# EAGLE design DEClampPanel (EAGLE 7.6.0)
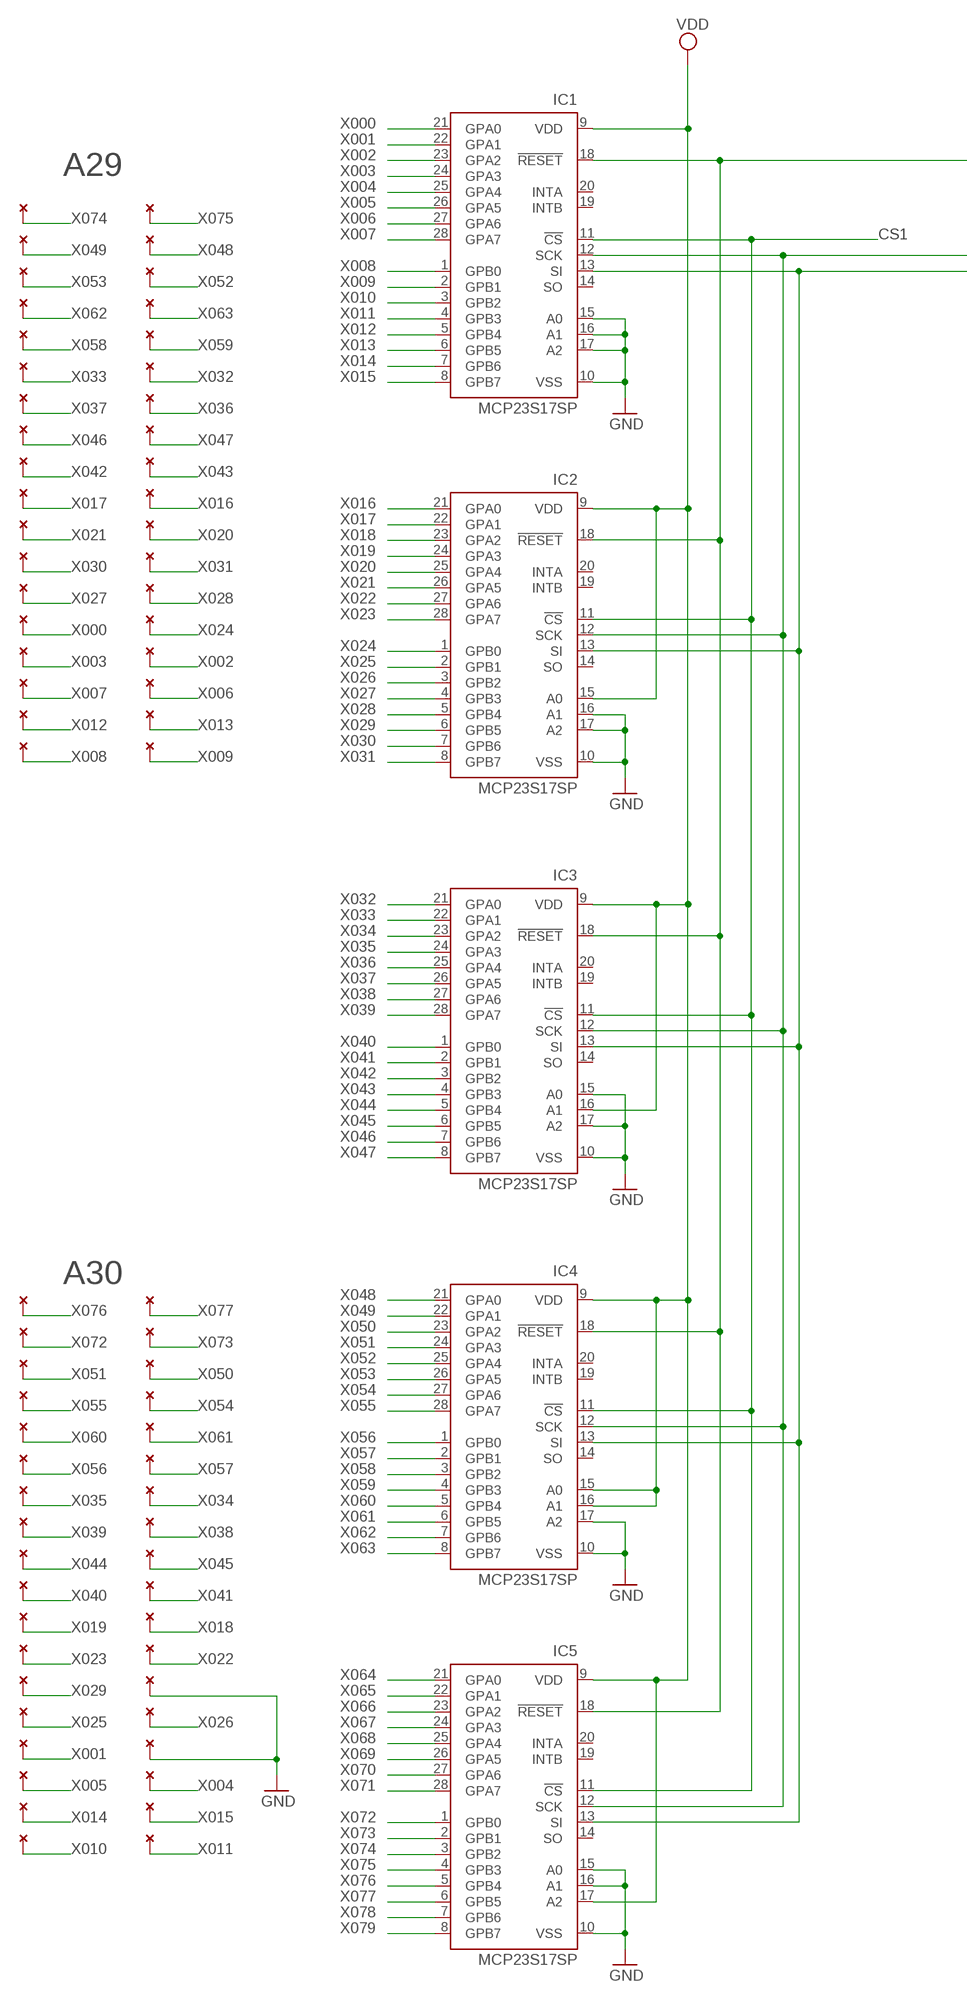
[diagram p0: schematic, sheet 1, part 1 of 2]
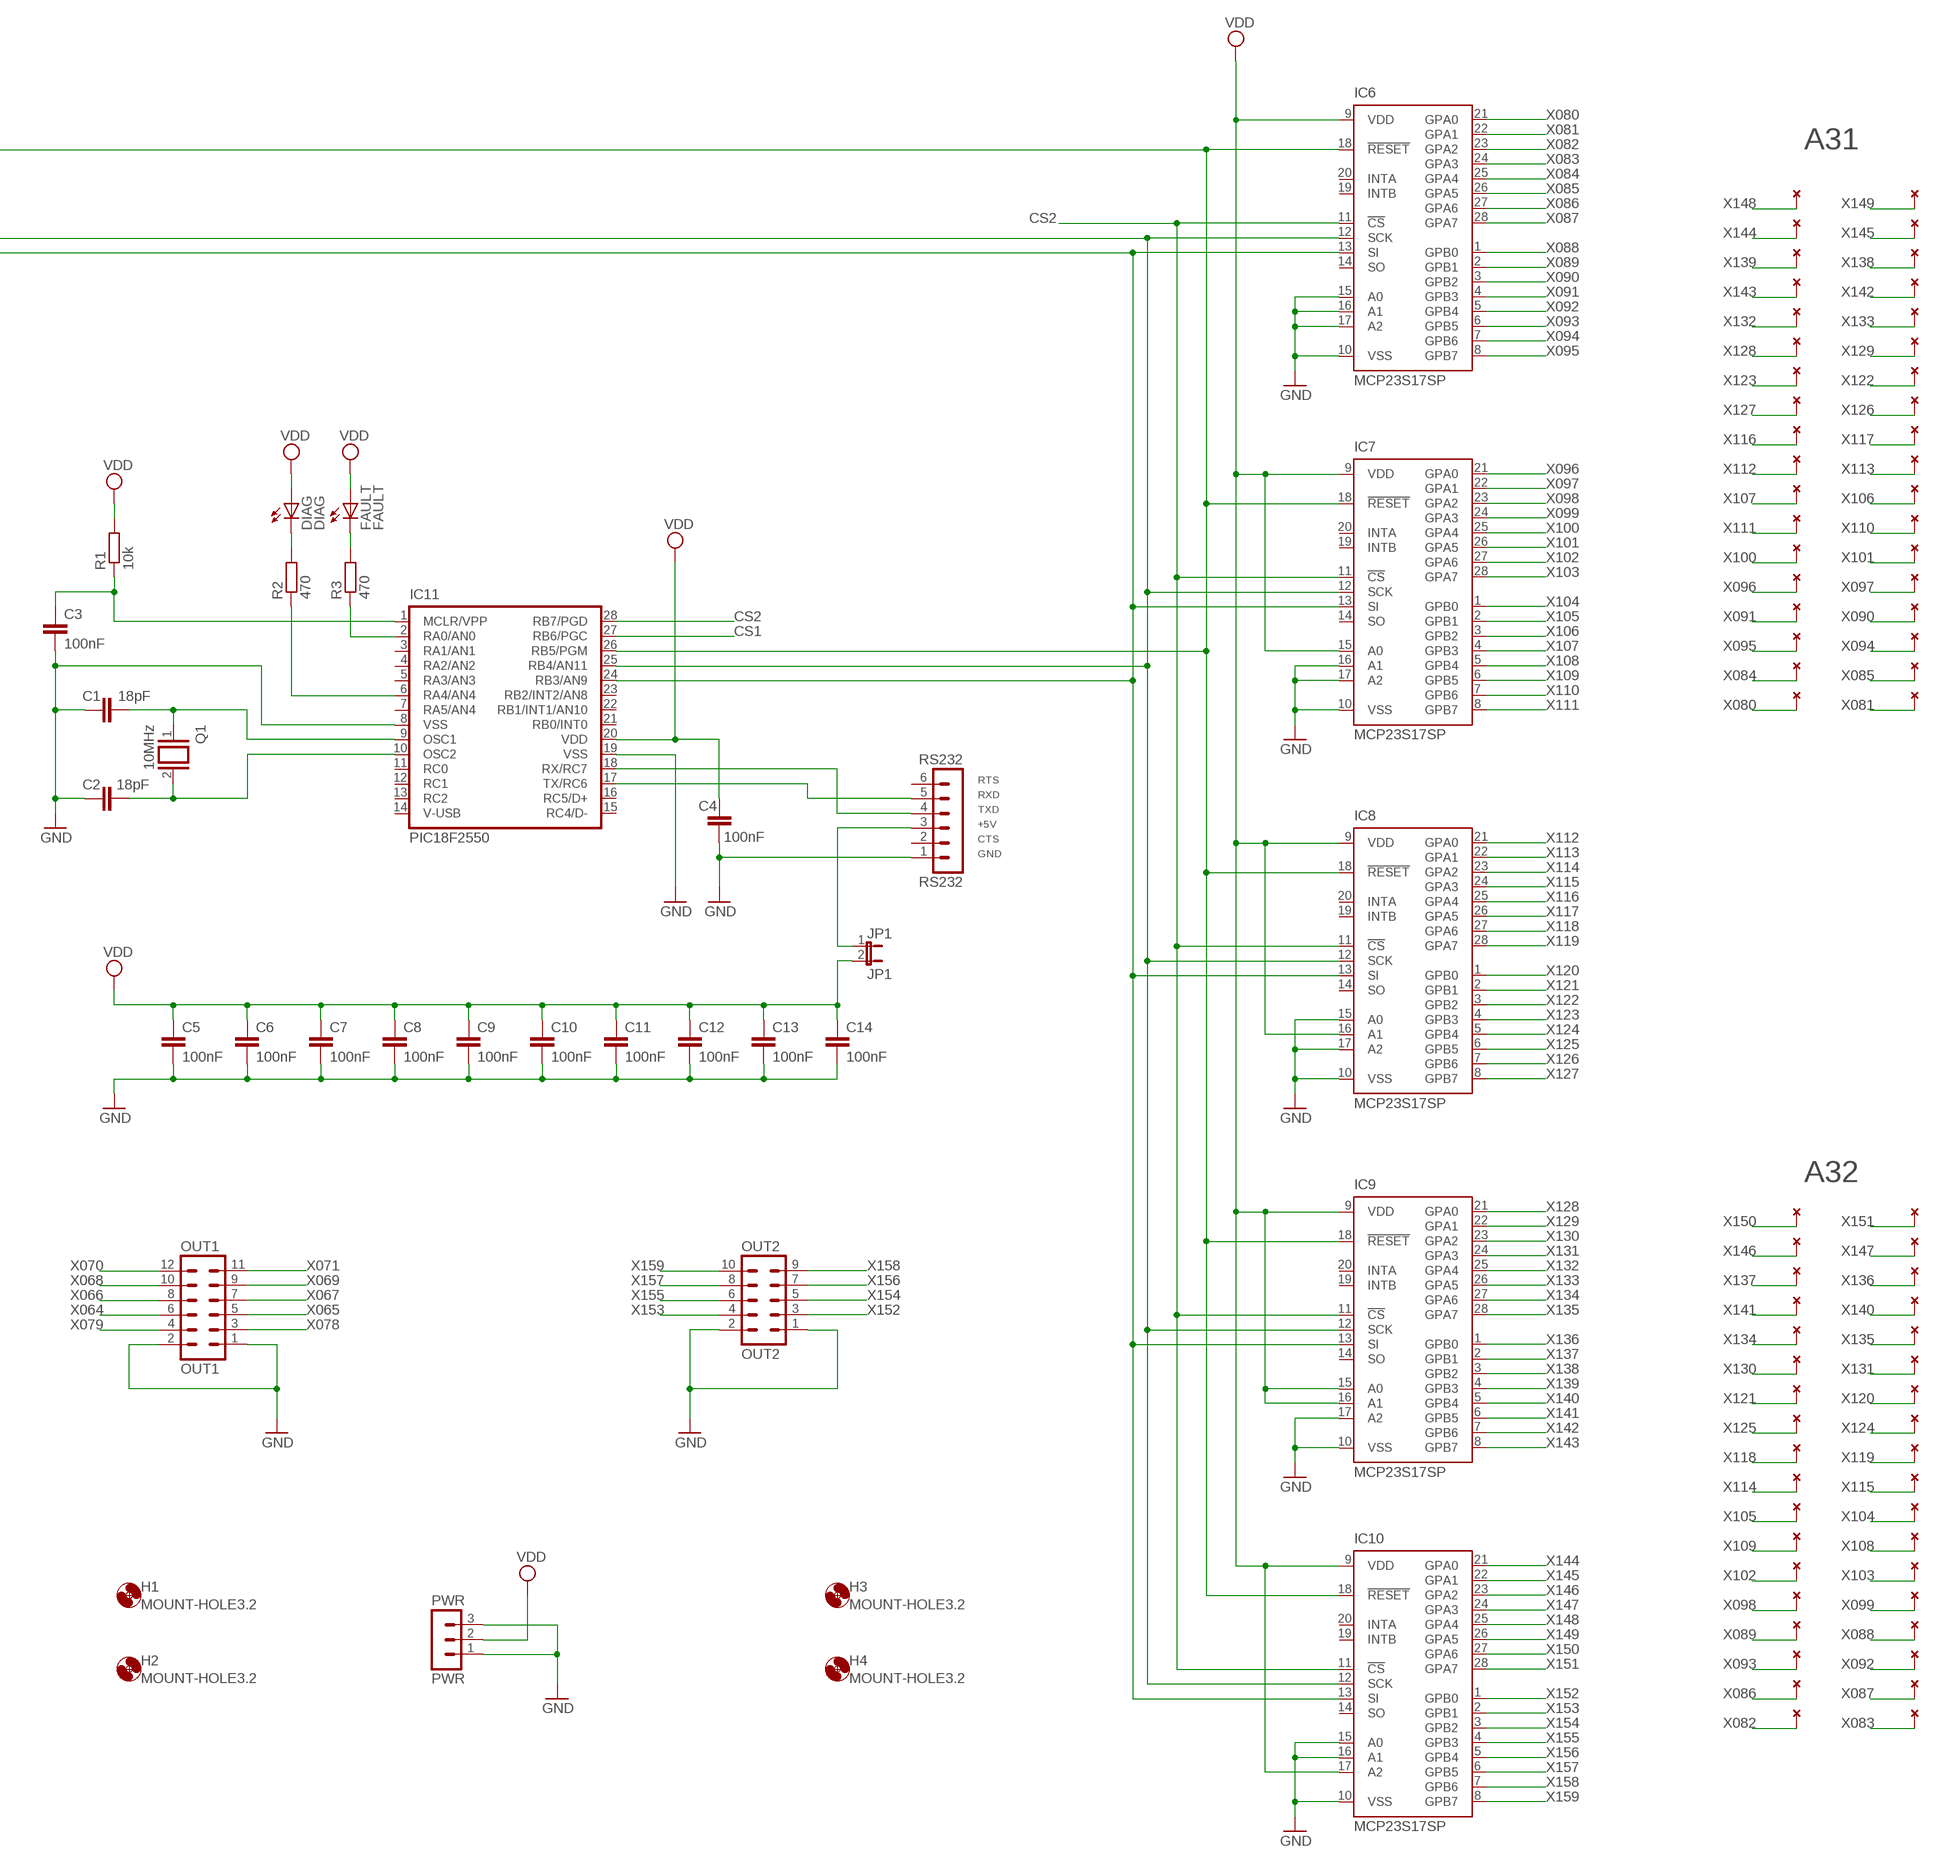
[diagram p1: schematic, sheet 1, part 2 of 2]

## Parts
A29  THRU-HOLE2W  [THRU-HOLE2]
A30  THRU-HOLE2W  [THRU-HOLE2]
A31  THRU-HOLE2W  [THRU-HOLE2]
A32  THRU-HOLE2W  [THRU-HOLE2]
C1  18pF  C-EU025-025X050  [C025-025X050]
C2  18pF  C-EU025-025X050  [C025-025X050]
C3  100nF  C-EU025-025X050  [C025-025X050]
C4  100nF  C-EU025-025X050  [C025-025X050]
C5  100nF  C-EU025-025X050  [C025-025X050]
C6  100nF  C-EU025-025X050  [C025-025X050]
C7  100nF  C-EU025-025X050  [C025-025X050]
C8  100nF  C-EU025-025X050  [C025-025X050]
C9  100nF  C-EU025-025X050  [C025-025X050]
C10  100nF  C-EU025-025X050  [C025-025X050]
C11  100nF  C-EU025-025X050  [C025-025X050]
C12  100nF  C-EU025-025X050  [C025-025X050]
C13  100nF  C-EU025-025X050  [C025-025X050]
C14  100nF  C-EU025-025X050  [C025-025X050]
DIAG  DIAG  LED3MM  [LED3MM]
FAULT  FAULT  LED3MM  [LED3MM]
H1  MOUNT-HOLE3.2  [3,2]
H2  MOUNT-HOLE3.2  [3,2]
H3  MOUNT-HOLE3.2  [3,2]
H4  MOUNT-HOLE3.2  [3,2]
IC1  MCP23S17SP  [DIL28-3]
IC2  MCP23S17SP  [DIL28-3]
IC3  MCP23S17SP  [DIL28-3]
IC4  MCP23S17SP  [DIL28-3]
IC5  MCP23S17SP  [DIL28-3]
IC6  MCP23S17SP  [DIL28-3]
IC7  MCP23S17SP  [DIL28-3]
IC8  MCP23S17SP  [DIL28-3]
IC9  MCP23S17SP  [DIL28-3]
IC10  MCP23S17SP  [DIL28-3]
IC11  PIC18F2550  [DIL28-3]
JP1  JP1  JUMPER-2PTH  [1X02]
OUT1  OUT1  MA06-2  [MA06-2]
OUT2  OUT2  MA05-2  [MA05-2]
PWR  PWR  MA03-1  [MA03-1]
Q1  10MHz  XTAL/S  [QS]
R1  10k  R-EU_0204/7  [0204/7]
R2  470  R-EU_0204/7  [0204/7]
R3  470  R-EU_0204/7  [0204/7]
RS232  RS232  MA06-1  [MA06-1]

## Nets
CS1: IC1.11(!CS) IC2.11(!CS) IC3.11(!CS) IC4.11(!CS) IC5.11(!CS) IC11.27(RB6/PGC)
CS2: IC6.11(!CS) IC7.11(!CS) IC8.11(!CS) IC9.11(!CS) IC10.11(!CS) IC11.28(RB7/PGD)
GND [GND]: A30.D2 A30.F2 C1.1 C2.1 C3.2 C4.2 C5.2 C6.2 C7.2 C8.2 C9.2 C10.2 C11.2 C12.2 C13.2 C14.2 IC1.10(VSS) IC1.15(A0) IC1.16(A1) IC1.17(A2) IC2.10(VSS) IC2.16(A1) IC2.17(A2) IC3.10(VSS) IC3.15(A0) IC3.17(A2) IC4.10(VSS) IC4.17(A2) IC5.10(VSS) IC5.15(A0) IC5.16(A1) IC6.10(VSS) IC6.15(A0) IC6.16(A1) IC6.17(A2) IC7.10(VSS) IC7.16(A1) IC7.17(A2) IC8.10(VSS) IC8.15(A0) IC8.17(A2) IC9.10(VSS) IC9.17(A2) IC10.10(VSS) IC10.15(A0) IC10.16(A1) IC11.8(VSS) IC11.19(VSS) OUT1.1 OUT1.2 OUT2.1 OUT2.2 PWR.1 PWR.3 RS232.1
N$1: IC1.18(!RESET) IC2.18(!RESET) IC3.18(!RESET) IC4.18(!RESET) IC5.18(!RESET) IC6.18(!RESET) IC7.18(!RESET) IC8.18(!RESET) IC9.18(!RESET) IC10.18(!RESET) IC11.26(RB5/PGM)
N$2: C1.2 IC11.9(OSC1) Q1.1
N$3: IC1.12(SCK) IC2.12(SCK) IC3.12(SCK) IC4.12(SCK) IC5.12(SCK) IC6.12(SCK) IC7.12(SCK) IC8.12(SCK) IC9.12(SCK) IC10.12(SCK) IC11.25(RB4/AN11)
N$4: IC1.13(SI) IC2.13(SI) IC3.13(SI) IC4.13(SI) IC5.13(SI) IC6.13(SI) IC7.13(SI) IC8.13(SI) IC9.13(SI) IC10.13(SI) IC11.24(RB3/AN9)
N$5: FAULT.K(C) R3.2
N$6: C2.2 IC11.10(OSC2) Q1.2
N$7: JP1.1 RS232.3
N$8: IC11.18(RX/RC7) RS232.4
N$9: IC11.17(TX/RC6) RS232.5
N$10: IC11.2(RA0/AN0) R3.1
N$11: C3.1 IC11.1(MCLR/VPP) R1.1
N$12: DIAG.K(C) R2.2
N$13: IC11.6(RA4/AN4) R2.1
VDD [VDD]: C4.1 C5.1 C6.1 C7.1 C8.1 C9.1 C10.1 C11.1 C12.1 C13.1 C14.1 DIAG.A FAULT.A IC1.9(VDD) IC2.9(VDD) IC2.15(A0) IC3.9(VDD) IC3.16(A1) IC4.9(VDD) IC4.15(A0) IC4.16(A1) IC5.9(VDD) IC5.17(A2) IC6.9(VDD) IC7.9(VDD) IC7.15(A0) IC8.9(VDD) IC8.16(A1) IC9.9(VDD) IC9.15(A0) IC9.16(A1) IC10.9(VDD) IC10.17(A2) IC11.20(VDD) JP1.2 PWR.2 R1.2
X000: A29.E1 IC1.21(GPA0)
X001: A30.D1 IC1.22(GPA1)
X002: A29.D2 IC1.23(GPA2)
X003: A29.D1 IC1.24(GPA3)
X004: A30.C2 IC1.25(GPA4)
X005: A30.C1 IC1.26(GPA5)
X006: A29.C2 IC1.27(GPA6)
X007: A29.C1 IC1.28(GPA7)
X008: A29.A1 IC1.1(GPB0)
X009: A29.A2 IC1.2(GPB1)
X010: A30.A1 IC1.3(GPB2)
X011: A30.A2 IC1.4(GPB3)
X012: A29.B1 IC1.5(GPB4)
X013: A29.B2 IC1.6(GPB5)
X014: A30.B1 IC1.7(GPB6)
X015: A30.B2 IC1.8(GPB7)
X016: A29.K2 IC2.21(GPA0)
X017: A29.K1 IC2.22(GPA1)
X018: A30.J2 IC2.23(GPA2)
X019: A30.J1 IC2.24(GPA3)
X020: A29.J2 IC2.25(GPA4)
X021: A29.J1 IC2.26(GPA5)
X022: A30.H2 IC2.27(GPA6)
X023: A30.H1 IC2.28(GPA7)
X024: A29.E2 IC2.1(GPB0)
X025: A30.E1 IC2.2(GPB1)
X026: A30.E2 IC2.3(GPB2)
X027: A29.F1 IC2.4(GPB3)
X028: A29.F2 IC2.5(GPB4)
X029: A30.F1 IC2.6(GPB5)
X030: A29.H1 IC2.7(GPB6)
X031: A29.H2 IC2.8(GPB7)
X032: A29.P2 IC3.21(GPA0)
X033: A29.P1 IC3.22(GPA1)
X034: A30.N2 IC3.23(GPA2)
X035: A30.N1 IC3.24(GPA3)
X036: A29.N2 IC3.25(GPA4)
X037: A29.N1 IC3.26(GPA5)
X038: A30.M2 IC3.27(GPA6)
X039: A30.M1 IC3.28(GPA7)
X040: A30.K1 IC3.1(GPB0)
X041: A30.K2 IC3.2(GPB1)
X042: A29.L1 IC3.3(GPB2)
X043: A29.L2 IC3.4(GPB3)
X044: A30.L1 IC3.5(GPB4)
X045: A30.L2 IC3.6(GPB5)
X046: A29.M1 IC3.7(GPB6)
X047: A29.M2 IC3.8(GPB7)
X048: A29.U2 IC4.21(GPA0)
X049: A29.U1 IC4.22(GPA1)
X050: A30.T2 IC4.23(GPA2)
X051: A30.T1 IC4.24(GPA3)
X052: A29.T2 IC4.25(GPA4)
X053: A29.T1 IC4.26(GPA5)
X054: A30.S2 IC4.27(GPA6)
X055: A30.S1 IC4.28(GPA7)
X056: A30.P1 IC4.1(GPB0)
X057: A30.P2 IC4.2(GPB1)
X058: A29.R1 IC4.3(GPB2)
X059: A29.R2 IC4.4(GPB3)
X060: A30.R1 IC4.5(GPB4)
X061: A30.R2 IC4.6(GPB5)
X062: A29.S1 IC4.7(GPB6)
X063: A29.S2 IC4.8(GPB7)
X064: IC5.21(GPA0) OUT1.6
X065: IC5.22(GPA1) OUT1.5
X066: IC5.23(GPA2) OUT1.8
X067: IC5.24(GPA3) OUT1.7
X068: IC5.25(GPA4) OUT1.10
X069: IC5.26(GPA5) OUT1.9
X070: IC5.27(GPA6) OUT1.12
X071: IC5.28(GPA7) OUT1.11
X072: A30.U1 IC5.1(GPB0)
X073: A30.U2 IC5.2(GPB1)
X074: A29.V1 IC5.3(GPB2)
X075: A29.V2 IC5.4(GPB3)
X076: A30.V1 IC5.5(GPB4)
X077: A30.V2 IC5.6(GPB5)
X078: IC5.7(GPB6) OUT1.3
X079: IC5.8(GPB7) OUT1.4
X080: A31.A1 IC6.21(GPA0)
X081: A31.A2 IC6.22(GPA1)
X082: A32.A1 IC6.23(GPA2)
X083: A32.A2 IC6.24(GPA3)
X084: A31.B1 IC6.25(GPA4)
X085: A31.B2 IC6.26(GPA5)
X086: A32.B1 IC6.27(GPA6)
X087: A32.B2 IC6.28(GPA7)
X088: A32.D2 IC6.1(GPB0)
X089: A32.D1 IC6.2(GPB1)
X090: A31.D2 IC6.3(GPB2)
X091: A31.D1 IC6.4(GPB3)
X092: A32.C2 IC6.5(GPB4)
X093: A32.C1 IC6.6(GPB5)
X094: A31.C2 IC6.7(GPB6)
X095: A31.C1 IC6.8(GPB7)
X096: A31.E1 IC7.21(GPA0)
X097: A31.E2 IC7.22(GPA1)
X098: A32.E1 IC7.23(GPA2)
X099: A32.E2 IC7.24(GPA3)
X100: A31.F1 IC7.25(GPA4)
X101: A31.F2 IC7.26(GPA5)
X102: A32.F1 IC7.27(GPA6)
X103: A32.F2 IC7.28(GPA7)
X104: A32.J2 IC7.1(GPB0)
X105: A32.J1 IC7.2(GPB1)
X106: A31.J2 IC7.3(GPB2)
X107: A31.J1 IC7.4(GPB3)
X108: A32.H2 IC7.5(GPB4)
X109: A32.H1 IC7.6(GPB5)
X110: A31.H2 IC7.7(GPB6)
X111: A31.H1 IC7.8(GPB7)
X112: A31.K1 IC8.21(GPA0)
X113: A31.K2 IC8.22(GPA1)
X114: A32.K1 IC8.23(GPA2)
X115: A32.K2 IC8.24(GPA3)
X116: A31.L1 IC8.25(GPA4)
X117: A31.L2 IC8.26(GPA5)
X118: A32.L1 IC8.27(GPA6)
X119: A32.L2 IC8.28(GPA7)
X120: A32.N2 IC8.1(GPB0)
X121: A32.N1 IC8.2(GPB1)
X122: A31.N2 IC8.3(GPB2)
X123: A31.N1 IC8.4(GPB3)
X124: A32.M2 IC8.5(GPB4)
X125: A32.M1 IC8.6(GPB5)
X126: A31.M2 IC8.7(GPB6)
X127: A31.M1 IC8.8(GPB7)
X128: A31.P1 IC9.21(GPA0)
X129: A31.P2 IC9.22(GPA1)
X130: A32.P1 IC9.23(GPA2)
X131: A32.P2 IC9.24(GPA3)
X132: A31.R1 IC9.25(GPA4)
X133: A31.R2 IC9.26(GPA5)
X134: A32.R1 IC9.27(GPA6)
X135: A32.R2 IC9.28(GPA7)
X136: A32.T2 IC9.1(GPB0)
X137: A32.T1 IC9.2(GPB1)
X138: A31.T2 IC9.3(GPB2)
X139: A31.T1 IC9.4(GPB3)
X140: A32.S2 IC9.5(GPB4)
X141: A32.S1 IC9.6(GPB5)
X142: A31.S2 IC9.7(GPB6)
X143: A31.S1 IC9.8(GPB7)
X144: A31.U1 IC10.21(GPA0)
X145: A31.U2 IC10.22(GPA1)
X146: A32.U1 IC10.23(GPA2)
X147: A32.U2 IC10.24(GPA3)
X148: A31.V1 IC10.25(GPA4)
X149: A31.V2 IC10.26(GPA5)
X150: A32.V1 IC10.27(GPA6)
X151: A32.V2 IC10.28(GPA7)
X152: IC10.1(GPB0) OUT2.3
X153: IC10.2(GPB1) OUT2.4
X154: IC10.3(GPB2) OUT2.5
X155: IC10.4(GPB3) OUT2.6
X156: IC10.5(GPB4) OUT2.7
X157: IC10.6(GPB5) OUT2.8
X158: IC10.7(GPB6) OUT2.9
X159: IC10.8(GPB7) OUT2.10
Unconnected: IC1.14(SO) IC1.19(INTB) IC1.20(INTA) IC2.14(SO) IC2.19(INTB) IC2.20(INTA) IC3.14(SO) IC3.19(INTB) IC3.20(INTA) IC4.14(SO) IC4.19(INTB) IC4.20(INTA) IC5.14(SO) IC5.19(INTB) IC5.20(INTA) IC6.14(SO) IC6.19(INTB) IC6.20(INTA) IC7.14(SO) IC7.19(INTB) IC7.20(INTA) IC8.14(SO) IC8.19(INTB) IC8.20(INTA) IC9.14(SO) IC9.19(INTB) IC9.20(INTA) IC10.14(SO) IC10.19(INTB) IC10.20(INTA) IC11.3(RA1/AN1) IC11.4(RA2/AN2) IC11.5(RA3/AN3) IC11.7(RA5/AN4) IC11.11(RC0) IC11.12(RC1) IC11.13(RC2) IC11.14(V-USB) IC11.15(RC4/D-) IC11.16(RC5/D+) IC11.21(RB0/INT0) IC11.22(RB1/INT1/AN10) IC11.23(RB2/INT2/AN8) RS232.2 RS232.6

## Notes on the sheet
- A31
- A29
- RTS
- RXD
- TXD
- +5V
- CTS
- GND
- A32
- A30

## Library data of the parts
A29-A32 = dec-con:THRU-HOLE2: Thru-Hole addition to double-sided edge connector.
C1-C14 = rcl:C-EU: CAPACITOR, European symbol
DIAG FAULT = henk:LED: LEDs Standard schematic elements and footprints for 5mm, 3mm, 1206, and 0603 sized LEDs. 5mm - Spark Fun Electronics SKU : COM-00529 (and others)
H1-H4 = holes:MOUNT-HOLE: MOUNTING HOLE with drill center marker
IC1-IC10 = microchip:MCP23S17: http://ww1.microchip.com/downloads/en/DeviceDoc/21952a.pdf Source: http://ww1.microchip.com/downloads/en/DeviceDoc/21952a.pdf; MF: MICROCHIP; MPN: MCP23S17-E/SP; OC_FARNELL: 1292238; OC_NEWARK: 31K2951
IC11 = henk:PIC18F2550
JP1 = henk:JUMPER-2: Jumper Basic 0.1" spaced jumper. Use with breakaway headers.
OUT1 = con-lstb:MA06-2: PIN HEADER; OC_FARNELL: unknown; OC_NEWARK: unknown
OUT2 = con-lstb:MA05-2: PIN HEADER; OC_FARNELL: unknown; OC_NEWARK: unknown
PWR = con-lstb:MA03-1: PIN HEADER; OC_FARNELL: unknown; OC_NEWARK: unknown
Q1 = special:XTAL/S: CRYSTAL
R1-R3 = rcl:R-EU_: RESISTOR, European symbol
RS232 = con-lstb:MA06-1: PIN HEADER; OC_FARNELL: unknown; OC_NEWARK: unknown

## Net classes
0 default: width 0.254 mm, drill 0.254 mm, clearance 0.254 mm
1 GND: width 0.508 mm, drill 0.508 mm, clearance 0.254 mm
2 VDD: width 0.508 mm, drill 0.508 mm, clearance 0.254 mm

## Board
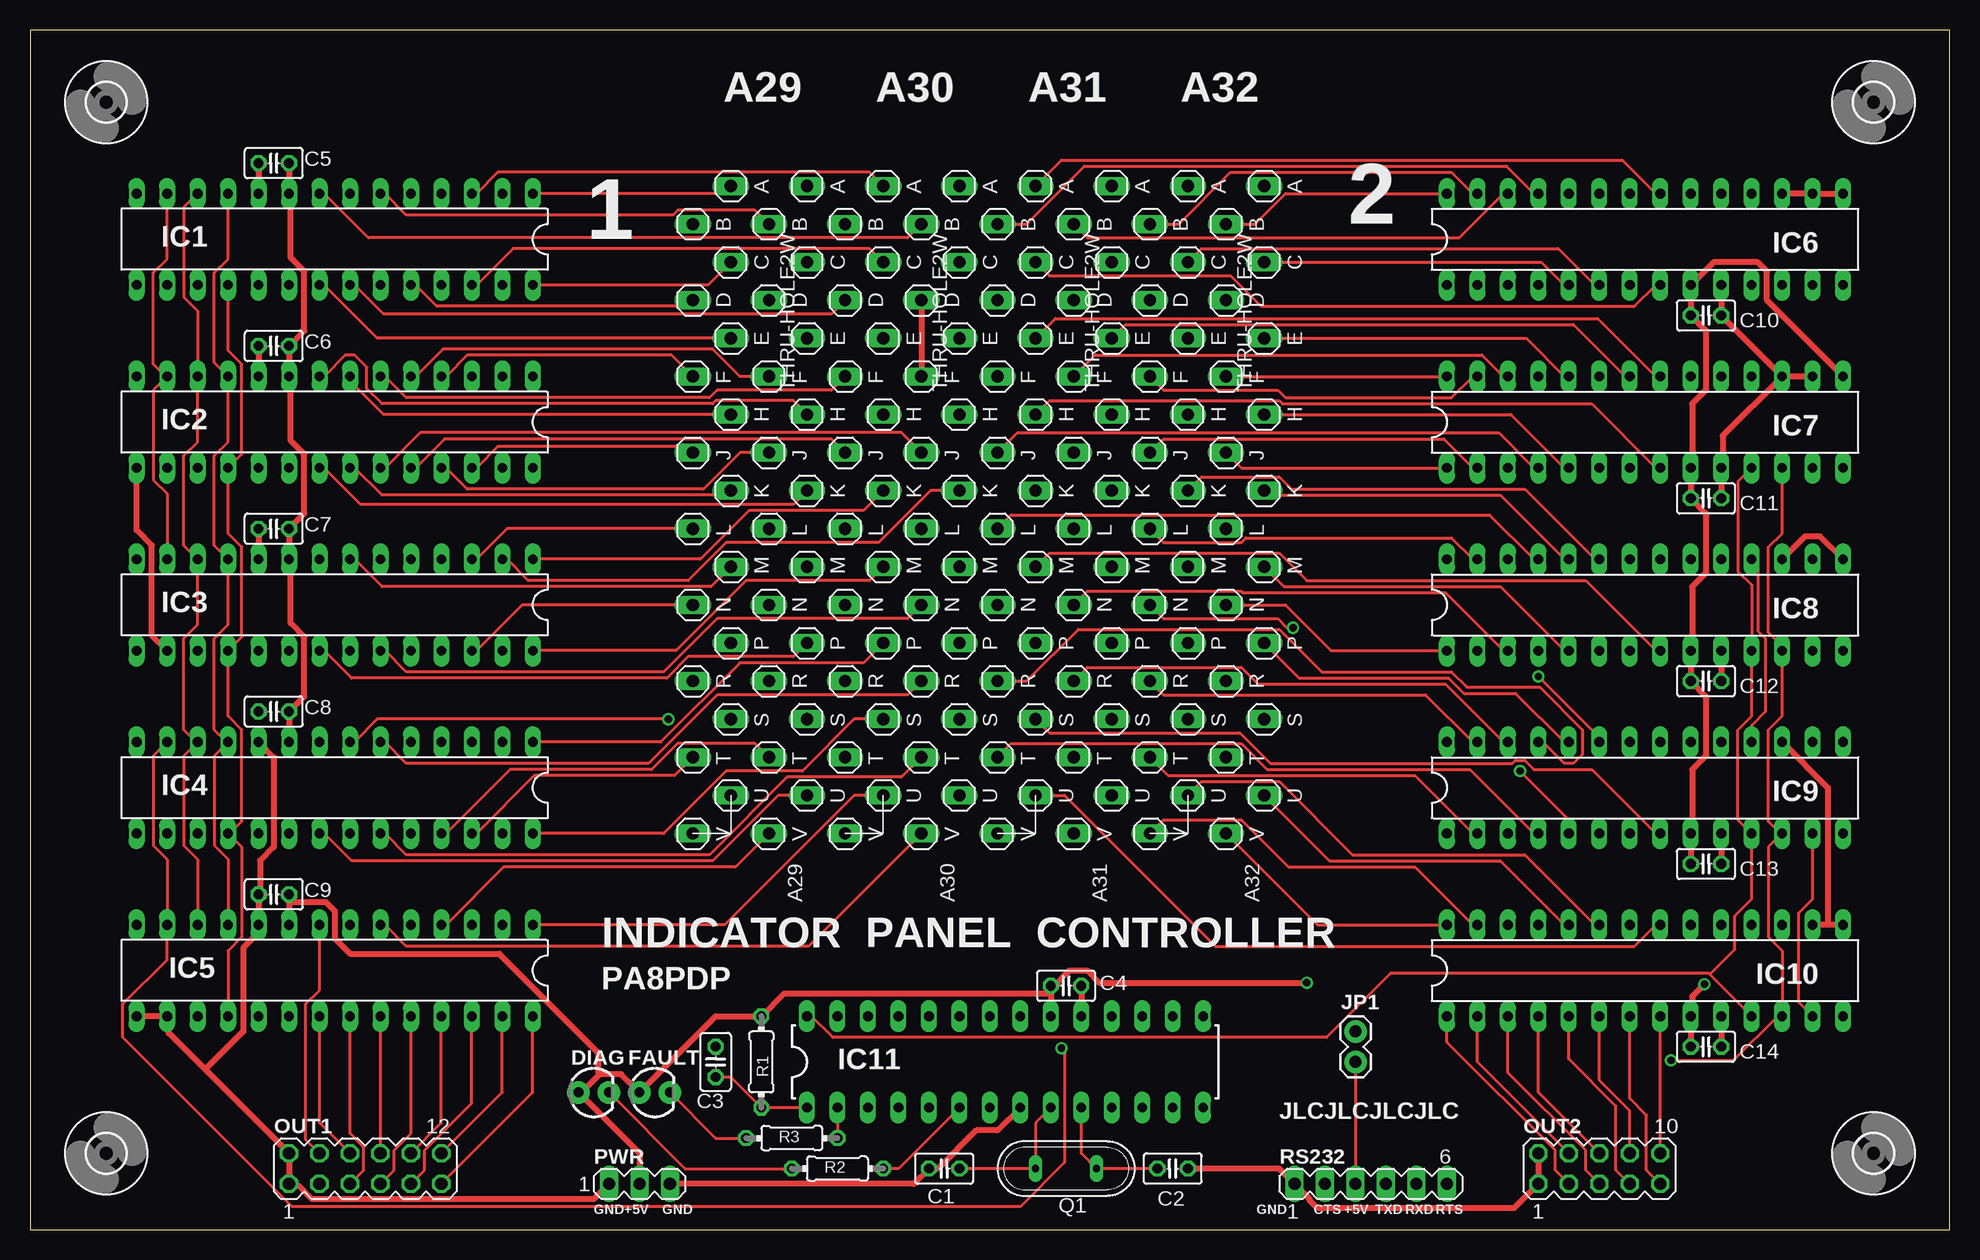
[diagram p2: board, top side]
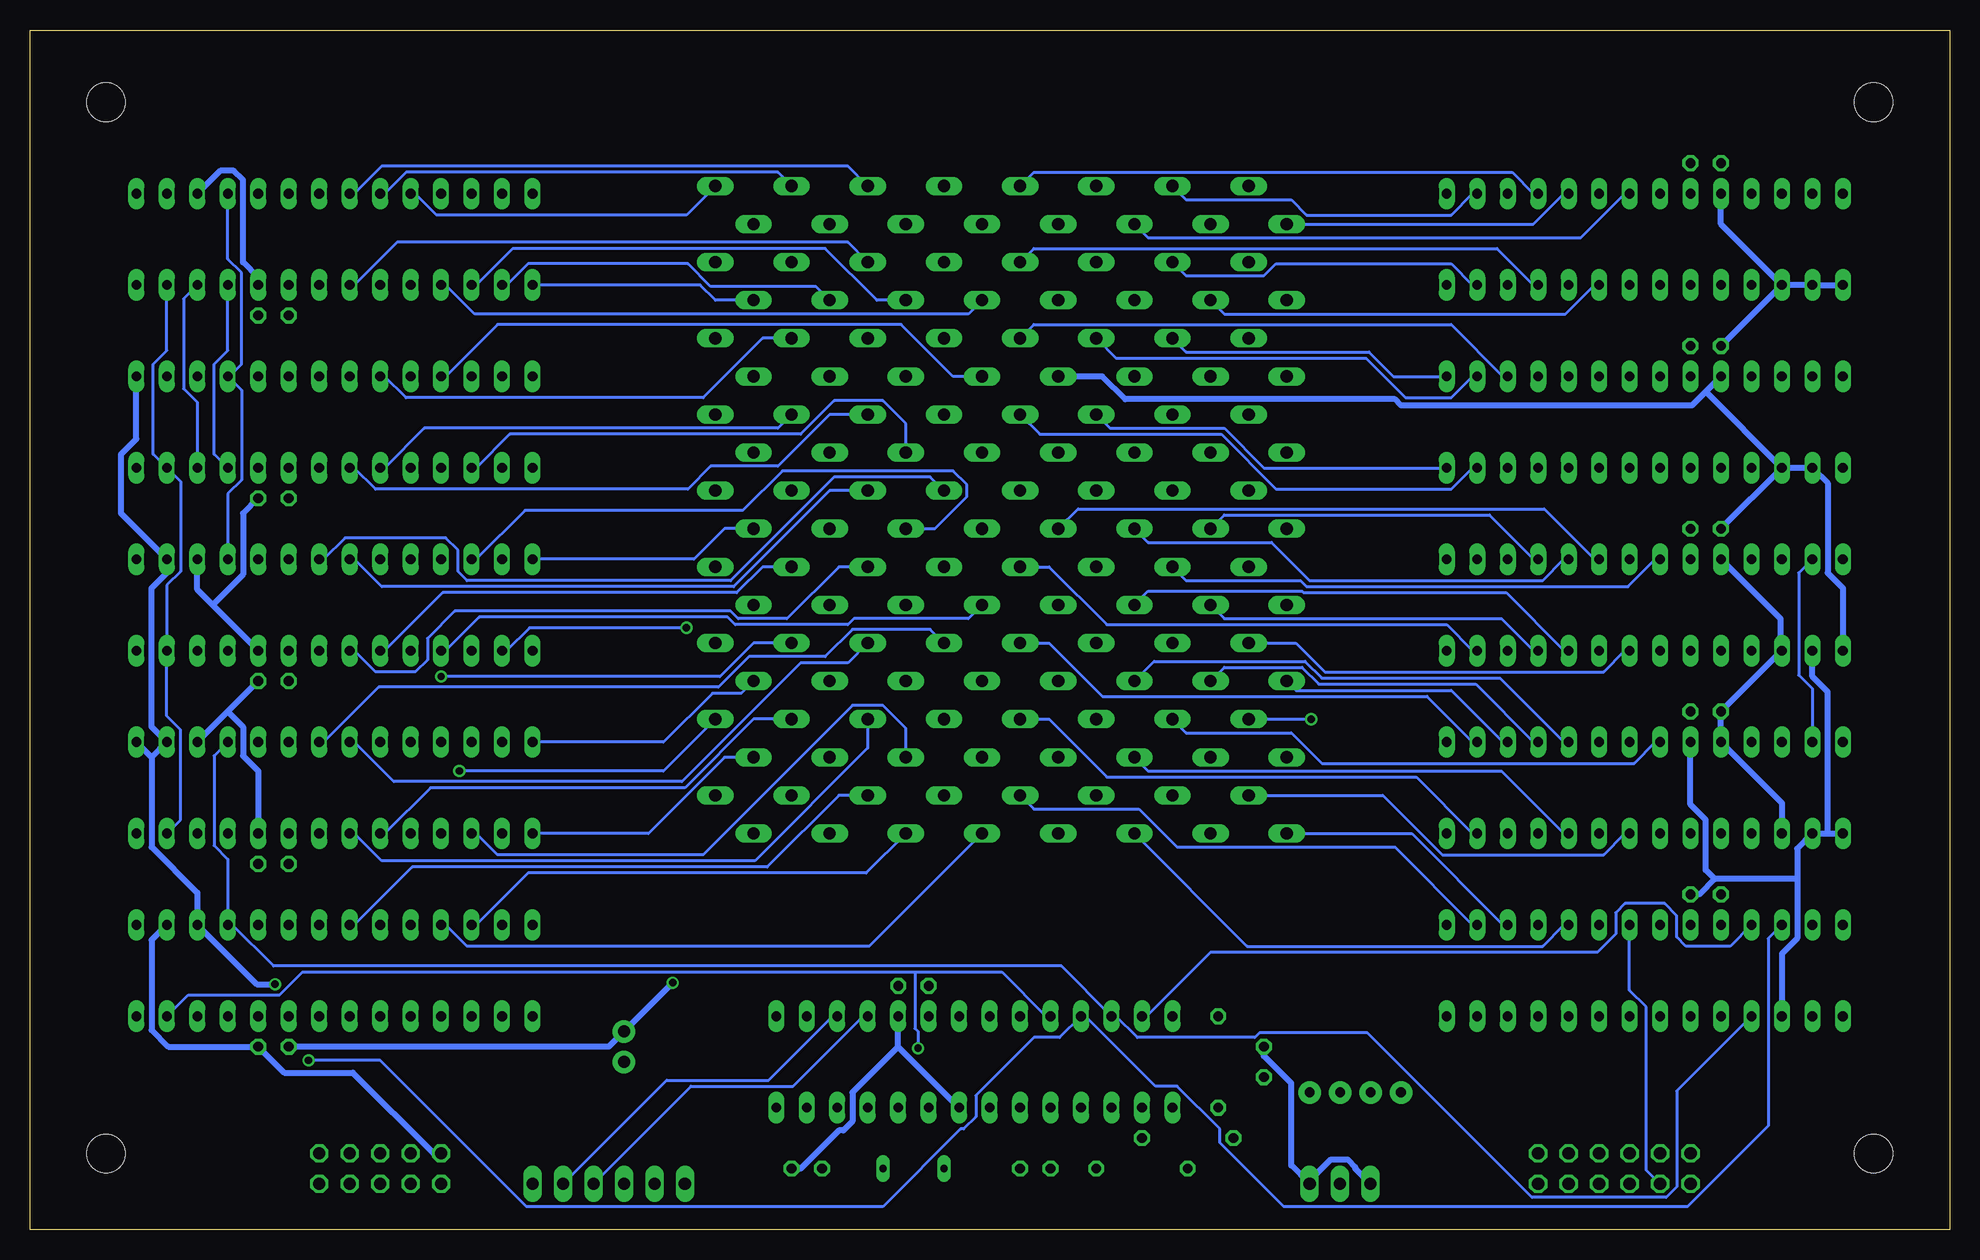
[diagram p3: board, bottom side, seen from below]

Size 160 x 100 mm. Coordinates in mm from the lower left corner, seen from the top.
Outline: 0,0 160,0 160,100 0,100 0,0
Copper layers (1*16): Top 0.035mm / dielectric 1.5mm / Bottom 0.035mm
Design rules "default": minimum track width 10mil, minimum drill 24mil, track to track 8mil, track to pad 8mil, pad to pad 8mil, via to via 8mil, smd to smd 8mil, copper to edge 40mil, drill to drill 8mil, minimum pad ring 10mil, minimum via ring 8mil, stop-mask expansion 4mil, vias tented up to drill 0mil, thermal gap 10mil

### Footprints (pad centres in the part's own frame; a part is rotated, then mirrored left to right if it is on the bottom)
THRU-HOLE2 = drill 1.016 long: A1 28.575,9.525; A2 28.575,3.175; B1 25.4,12.7; B2 25.4,6.35; C1 22.225,9.525; C2 22.225,3.175; D1 19.05,12.7; D2 19.05,6.35; E1 15.875,9.525; E2 15.875,3.175; F1 12.7,12.7; F2 12.7,6.35; H1 9.525,9.525; H2 9.525,3.175; J1 6.35,12.7; J2 6.35,6.35; K1 3.175,9.525; K2 3.175,3.175; L1 0,12.7; L2 0,6.35; M1 -3.175,9.525; M2 -3.175,3.175; N1 -6.35,12.7; N2 -6.35,6.35; P1 -9.525,9.525; P2 -9.525,3.175; R1 -12.7,12.7; R2 -12.7,6.35; S1 -15.875,9.525; S2 -15.875,3.175; T1 -19.05,12.7; T2 -19.05,6.35; U1 -22.225,9.525; U2 -22.225,3.175; V1 -25.4,12.7; V2 -25.4,6.35
C025-025X050 = drill 0.813 octagon: 1 -1.27,0; 2 1.27,0
LED3MM = drill 0.813 pad 1.88: A -1.27,0; K 1.27,0
3,2 = hole 3.2: 0,0
DIL28-3 = drill 0.813 long: 1 -16.51,-3.81; 2 -13.97,-3.81; 3 -11.43,-3.81; 4 -8.89,-3.81; 5 -6.35,-3.81; 6 -3.81,-3.81; 7 -1.27,-3.81; 8 1.27,-3.81; 9 3.81,-3.81; 10 6.35,-3.81; 11 8.89,-3.81; 12 11.43,-3.81; 13 13.97,-3.81; 14 16.51,-3.81; 15 16.51,3.81; 16 13.97,3.81; 17 11.43,3.81; 18 8.89,3.81; 19 6.35,3.81; 20 3.81,3.81; 21 1.27,3.81; 22 -1.27,3.81; 23 -3.81,3.81; 24 -6.35,3.81; 25 -8.89,3.81; 26 -11.43,3.81; 27 -13.97,3.81; 28 -16.51,3.81
1X02 = drill 1.016 pad 1.88: 1 0,0; 2 2.54,0
MA06-2 = drill 1.016 octagon: 1 -6.35,-1.27; 2 -6.35,1.27; 3 -3.81,-1.27; 4 -3.81,1.27; 5 -1.27,-1.27; 6 -1.27,1.27; 7 1.27,-1.27; 8 1.27,1.27; 9 3.81,-1.27; 10 3.81,1.27; 11 6.35,-1.27; 12 6.35,1.27
MA05-2 = drill 1.016 octagon: 1 -5.08,-1.27; 2 -5.08,1.27; 3 -2.54,-1.27; 4 -2.54,1.27; 5 0,-1.27; 6 0,1.27; 7 2.54,-1.27; 8 2.54,1.27; 9 5.08,-1.27; 10 5.08,1.27
MA03-1 = drill 1.016 long: 1 -2.54,0; 2 0,0; 3 2.54,0
QS = drill 0.61 long: 1 -2.54,0; 2 2.54,0
0204/7 = drill 0.813 octagon: 1 -3.81,0; 2 3.81,0
MA06-1 = drill 1.016 long: 1 -6.35,0; 2 -3.81,0; 3 -1.27,0; 4 1.27,0; 5 3.81,0; 6 6.35,0

### Placement (x,y rotation side)
A29  67.94,58.42 90 top
A30  80.64,58.42 90 top
A31  93.34,58.42 90 top
A32  106.05,58.42 90 top
C1  76.2,5.08 0 top
C2  95.25,5.08 180 top
C3  57.15,13.97 90 top
C4  86.36,20.32 0 top
C5  20.32,88.9 180 top
C6  20.32,73.66 180 top
C7  20.32,58.42 180 top
C8  20.32,43.18 180 top
C9  20.32,27.94 180 top
C10  139.7,76.2 0 top
C11  139.7,60.96 0 top
C12  139.7,45.72 0 top
C13  139.7,30.48 0 top
C14  139.7,15.24 0 top
DIAG  46.99,11.43 0 top
FAULT  52.07,11.43 0 top
H1  6.35,93.98 0 top
H2  6.35,6.35 0 top
H3  153.67,6.35 0 top
H4  153.67,93.98 0 top
IC1  25.4,82.55 180 top
IC2  25.4,67.31 180 top
IC3  25.4,52.07 180 top
IC4  25.4,36.83 180 top
IC5  25.4,21.59 180 top
IC6  134.62,82.55 0 top
IC7  134.62,67.31 0 top
IC8  134.62,52.07 0 top
IC9  134.62,36.83 0 top
IC10  134.62,21.59 0 top
IC11  81.28,13.97 0 top
JP1  110.49,13.97 90 top
OUT1  27.94,5.08 0 top
OUT2  130.81,5.08 0 top
PWR  50.8,3.81 0 top
Q1  86.36,5.08 0 top
R1  60.96,13.97 90 top
R2  67.31,5.08 180 top
R3  63.5,7.62 180 top
RS232  111.76,3.81 0 top

### Tracks (layer width: path | path; a pad name or v marks a point on that pad's centre or on a via)
CS1
  Top 0.254: IC5.11 16.51,30.86 15.37,32 15.37,39.5 IC4.11 16.38,40.64 15.37,41.66 15.37,49.28 16.51,50.42 IC3.11 15.37,57.02 15.37,64.52 16.51,65.66 IC2.11 15.37,72.26 15.37,79.76 16.51,80.9 IC1.11
  Bottom 0.254: IC11.27 66.93,17.78 61.59,23.11 29.34,23.11 27.81,24.64 27.81,26.42 27.05,27.18 23.75,27.18 22.73,26.16 22.73,24.38 21.97,23.62 18.29,23.62 IC5.11
CS2
  Top 0.254: IC7.11 142.37,62.36 142.37,54.86 143.51,53.72 IC8.11 143.51,42.8 142.37,41.66 142.37,34.16 IC9.11 143.51,27.56 142.11,26.16 142.11,23.37 140.02,21.27 | IC11.28 65.15,17.78 66.93,16 108.08,16 113.41,21.34 139.95,21.34 140.02,21.27 | IC10.11 140.02,21.27
  Bottom 0.254: IC6.11 143.51,73.28 144.65,72.14 144.65,64.64 IC7.11
GND
  Top 0.508: IC5.15 IC5.16 11.56,17.65 11.56,16.38 14.61,13.34 | 14.61,13.34 OUT1.2 OUT1.1 21.72,3.68 22.35,3.68 23.5,2.54 46.99,2.54 PWR.1 | IC4.10 20.32,39.37 20.32,31.88 19.18,30.73 19.18,28.07 C9.2 IC5.10 18.92,25.27 18.92,24.64 17.78,23.5 17.78,16.51 14.61,13.34 | C7.2 IC3.10 | A30.D2 A30.F2 | C5.2 IC1.10 | C6.2 IC2.10 | C2.1 104.14,5.08 RS232.1 106.68,2.54 106.68,2.41 107.31,1.78 123.7,1.78 OUT2.1 OUT2.2 | C4.2 IC11.19 | IC11.8 80.64,8.26 78.87,8.26 75.69,5.08 C1.1 73.66,3.81 PWR.3 | IC10.10 C14.2 | IC10.15 149.86,25.4 | 149.86,25.4 IC10.16 | IC8.17 147.96,57.78 149.22,57.78 IC8.15 | IC9.10 C13.2 | IC8.10 C12.2 | IC6.17 IC6.16 IC6.15 | IC6.10 C10.2 IC7.17 | C11.2 IC7.10 141.1,63.63 141.1,66.17 IC7.17 | IC7.16 IC7.17 | 149.86,25.4 149.86,36.83 IC9.17
  Bottom 0.508: IC4.17 13.97,35.56 IC4.10 C8.2 IC3.17 14.1,48.39 14.1,50.93 IC3.10 | IC3.15 8.89,53.47 10.16,54.74 10.16,62.23 IC2.16 IC2.17 | IC2.17 C7.2 | IC1.15 IC1.16 IC1.17 | IC1.17 C6.2 | IC1.10 19.05,83.82 IC1.17 | A30.F2 70.61,71.12 68.71,69.22 46.23,69.22 45.72,68.71 21.46,68.71 20.32,69.85 | IC2.10 20.32,69.85 | 20.32,69.85 IC2.17 | C3.2 57.15,14.48 54.86,12.19 54.86,5.33 PWR.3 53.34,4.06 51.56,5.84 50.16,5.84 49.53,5.21 49.53,5.08 PWR.1 | 87.63,15.24 IC11.19 | IC11.8 87.63,15.24 | C2.1 95.76,5.08 92.58,8.26 92.2,8.26 91.44,9.02 91.44,11.43 87.63,15.24 | IC10.16 149.86,24.13 149.86,16.64 148.46,15.24 C14.2 138.81,13.08 133.1,13.08 126.36,6.35 OUT2.2 | C12.2 143.51,43.18 | 143.51,43.18 IC9.17 | IC9.10 140.97,38.23 142.24,39.5 142.24,41.91 143.51,43.18 | IC8.17 146.05,53.34 144.78,52.07 | IC8.10 144.78,52.07 | IC6.17 144.15,88.27 143,88.27 142.24,87.5 142.24,80.64 140.97,79.38 IC6.10 | 144.78,52.07 142.24,54.61 142.24,59.69 C11.2
N$1
  Top 0.254: IC9.18 143.51,42.04 144.65,43.18 144.65,49.28 144.02,49.91 144.02,55.37 IC8.18 | IC5.18 16.51,23.24 17.65,24.38 17.65,31.88 IC4.18 16.64,33.02 17.65,34.04 17.65,41.66 16.51,42.8 IC3.18 17.65,49.4 17.65,56.9 16.51,58.04 IC2.18 17.65,64.64 17.65,72.14 16.51,73.28 IC1.18
  Bottom 0.254: IC9.18 144.65,39.5 144.65,32 143.51,30.86 IC10.18 143.13,25.4 139.7,21.97 74.04,21.97 IC11.26 69.47,17.78 67.69,16 57.91,16 57.53,16.38 48.51,16.38 34.8,2.67 23.62,2.67 22.73,3.56 22.73,11.56 IC5.18 | IC8.18 143.51,61.34 142.37,62.48 142.37,69.98 IC7.18 143.38,71.12 142.37,72.14 142.37,79.76 143.51,80.9 IC6.18
N$2
  Top 0.254: IC11.9 83.82,8.89 Q1.1 C1.2
N$3  (via drill 0.61)
  Top 0.254: IC7.12 146.05,58.04 144.91,56.9 144.91,49.78 146.05,48.64 IC8.12 146.05,42.8 144.91,41.66 144.91,34.04 145.92,33.02 IC9.12 144.91,31.88 144.91,24.38 146.05,23.24 IC10.12 145.67,17.78 141.99,14.1 v136.78,14.1 | IC1.12 12.83,85.22 12.83,77.72 13.97,76.58 IC2.12 13.97,65.66 12.83,64.52 12.83,57.02 IC3.12 13.97,50.42 12.83,49.28 12.83,41.66 13.84,40.64 IC4.12 12.83,39.5 12.83,32 13.97,30.86 IC5.12
  Bottom 0.254: IC7.12 146.05,68.96 147.19,70.1 147.19,77.6 IC6.12 | IC5.12 15.11,24.26 15.11,8.64 21.84,1.91 55.5,1.91 60.83,7.24 60.83,8.38 64.39,11.94 66.17,11.94 72.01,17.78 IC11.25 74.17,16 76.33,16 81.15,11.18 81.15,9.4 82.17,8.38 82.42,8.38 88.9,1.91 118.62,1.91 130.81,14.1 v136.78,14.1
N$4  (via drill 0.61)
  Top 0.254: IC4.13 10.29,39.5 10.29,32 11.43,30.86 IC5.13 11.43,22.48 7.75,18.8 7.75,16 21.84,1.91 82.55,1.91 86.23,5.59 86.23,14.86 v85.98,15.11 | IC3.13 11.43,61.34 10.29,62.48 10.29,69.98 IC2.13 11.3,71.12 10.29,72.14 10.29,79.76 11.43,80.9 IC1.13 | IC9.13 148.59,27.56 147.45,26.42 147.45,18.92 IC10.13
  Bottom 0.254: IC4.13 11.43,45.09 12.57,46.23 12.57,54.74 IC3.13 | IC6.13 148.59,73.28 149.73,72.14 149.73,64.64 IC7.13 147.45,62.36 147.45,54.86 148.59,53.72 IC8.13 148.59,42.8 147.45,41.66 147.45,34.16 IC9.13 | IC11.24 75.31,17.78 78.99,21.46 86.23,21.46 | 86.23,21.46 137.29,21.46 139.19,19.56 146.81,19.56 IC10.13 | v85.98,15.11 85.98,16.51 86.23,16.76 86.23,21.46
N$5
  Top 0.254: R3.2 57.15,7.62 FAULT.K
N$6
  Top 0.254: C2.2 Q1.2 87.63,6.35 IC11.10
N$7
  Top 0.254: JP1.1 RS232.3
N$8
  Bottom 0.254: IC11.18 90.55,17.78 96.39,11.94 104.9,11.94 RS232.4
N$9
  Bottom 0.254: IC11.17 93.09,17.78 98.42,12.45 106.93,12.45 RS232.5
N$10
  Top 0.254: IC11.2 R3.1
N$11
  Top 0.254: IC11.1 R1.1 58.42,12.7 C3.1
N$12
  Top 0.254: R2.2 54.61,5.08 DIAG.K
N$13
  Top 0.254: R2.1 72.39,5.08 IC11.6
VDD  (via drill 0.61)
  Top 0.508: C13.1 IC9.9 138.56,33.15 138.56,38.35 139.7,39.5 139.7,44.45 C12.1 IC8.9 138.56,48.39 138.56,53.59 139.7,54.74 139.7,59.69 C11.1 IC7.9 138.56,63.63 138.56,68.83 139.7,69.98 139.7,74.93 C10.1 IC6.9 140.34,80.64 144.02,80.64 144.78,79.88 144.78,77.47 IC7.15 | C14.1 IC10.9 138.56,17.91 138.56,19.43 v139.57,20.45 | PWR.2 50.8,6.35 DIAG.A 45.97,11.43 47.5,12.95 | C4.1 IC11.20 | C4.1 84.96,19.68 62.87,19.68 R1.2 57.15,17.78 FAULT.A 49.28,12.95 47.5,12.95 | C5.1 IC1.9 21.72,86.23 21.72,81.03 22.86,79.88 22.86,74.93 C6.1 IC2.9 21.72,70.99 21.72,65.79 22.86,64.64 22.86,59.69 C7.1 IC3.9 21.72,55.75 21.72,50.55 22.86,49.4 22.86,44.45 C8.1 IC4.9 | IC5.9 C9.1 21.72,27.3 24.64,27.3 25.4,26.54 25.4,24.26 26.67,22.99 39.12,22.99 47.37,14.73 47.37,13.08 47.5,12.95 | IC2.15 8.89,58.29 10.16,57.02 10.16,49.53 IC3.16 | v106.43,20.57 89.15,20.57 88.14,21.59 86.61,21.59 85.34,20.32 C4.1
  Bottom 0.508: C14.1 111.76,15.24 JP1.2 v106.43,20.57 | 149.86,39.37 149.86,31.88 146.05,28.07 IC10.17 141.1,20.45 v139.57,20.45 | 149.86,39.37 IC9.16 149.86,41.91 149.86,53.47 148.59,54.74 IC8.16 152.4,59.69 152.4,64.64 151.13,65.91 IC7.15 | 149.86,39.37 IC9.15 | IC5.17 13.97,22.99 12.7,24.26 12.7,29.21 | 12.7,29.21 12.7,31.75 IC4.16 10.16,33.02 | 10.16,33.02 IC4.15 | IC3.16 11.43,46.1 10.16,44.83 10.16,33.02 | C9.1 20.83,27.94 19.56,29.21 | 12.7,29.21 19.56,29.21 | IC4.9 21.59,35.43 20.32,34.16 20.32,29.97 19.56,29.21
X000
  Top 0.254: IC1.21 24.51,78.74 28.96,74.3 A29.E1
X001
  Top 0.254: IC1.22 27.05,78.74 29.46,76.33 66.8,76.33 A30.D1
X002
  Bottom 0.254: IC1.23 29.59,78.74 32,76.33 60.45,76.33 A29.D2
X003
  Top 0.254: IC1.24 32.13,78.74 33.91,76.96 54.74,76.96 A29.D1
X004
  Bottom 0.254: IC1.25 34.67,78.74 37.72,81.79 76.33,81.79 A30.C2
X005
  Top 0.254: IC1.26 37.21,78.74 40.26,81.79 69.98,81.79 A30.C1
X006
  Bottom 0.254: IC1.27 39.75,78.74 41.53,80.52 56.13,80.52 57.15,79.5 63.63,79.5 A29.C2
X007
  Top 0.254: IC1.28 56.52,78.74 A29.C1
X008
  Top 0.254: IC1.1 57.78,86.36 A29.A1
X009
  Bottom 0.254: IC1.2 39.75,86.36 41.53,84.58 53.59,84.58 54.86,85.85 63.63,85.85 A29.A2
X010
  Top 0.254: IC1.3 37.21,86.36 38.99,88.14 69.98,88.14 A30.A1
X011
  Bottom 0.254: IC1.4 34.67,86.36 36.45,88.14 76.33,88.14 A30.A2
X012
  Bottom 0.254: IC1.5 32.13,86.36 34.67,83.82 A29.B1
X013
  Top 0.254: IC1.6 29.59,86.36 31.37,84.58 53.59,84.58 53.98,84.96 60.45,84.96 A29.B2
X014
  Bottom 0.254: IC1.7 27.05,86.36 30.73,82.68 66.8,82.68 A30.B1
X015
  Top 0.254: IC1.8 24.51,86.36 28.19,82.68 73.15,82.68 A30.B2
X016
  Top 0.254: IC2.21 24.51,63.5 27.56,60.45 63.63,60.45 A29.K2
X017
  Top 0.254: IC2.22 27.05,63.5 29.34,61.21 58.04,61.21 A29.K1
X018
  Top 0.254: IC2.23 29.59,63.5 32.51,66.42 72.64,66.42 A30.J2
X019
  Top 0.254: IC2.24 32.13,63.5 34.54,65.91 66.8,65.91 A30.J1
X020
  Top 0.254: IC2.25 34.67,63.5 36.45,61.72 56.13,61.72 59.18,64.77 A29.J2
X021
  Top 0.254: IC2.26 37.21,63.5 38.99,65.28 54.74,65.28 A29.J1
X022
  Bottom 0.254: IC2.27 39.75,63.5 41.53,61.72 56.13,61.72 60.71,66.29 75.82,66.29 A30.H2
X023
  Bottom 0.254: IC2.28 57.15,63.5 60.45,66.8 69.98,66.8 A30.H1
X024
  Bottom 0.254: IC2.1 46.35,71.12 48.39,73.15 63.63,73.15 A29.E2
X025
  Bottom 0.254: IC2.2 39.75,71.12 41.53,69.34 45.34,69.34 48.64,72.64 69.47,72.64 A30.E1
X026
  Bottom 0.254: IC2.3 37.21,71.12 41.53,75.44 76.33,75.44 A30.E2
X027
  Top 0.254: IC2.4 34.67,71.12 36.45,72.9 53.47,72.9 A29.F1
X028
  Top 0.254: IC2.5 32.13,71.12 34.42,73.41 56.9,73.41 59.18,71.12 A29.F2
X029
  Top 0.254: IC2.6 29.59,71.12 31.37,69.34 56.64,69.34 57.28,69.98 66.8,69.98 A30.F1
X030
  Top 0.254: IC2.7 26.67,70.74 29.46,67.94 A29.H1
X031
  Top 0.254: IC2.8 24.51,71.12 26.29,72.9 27.05,72.9 28.07,71.88 28.07,70.1 29.34,68.83 56.9,68.83 57.15,69.09 63.63,69.09 A29.H2
X032
  Top 0.254: IC3.21 24.51,48.26 26.8,45.97 53.09,45.97 54.86,47.75 63.63,47.75 A29.P2
X033
  Bottom 0.254: IC3.22 27.05,48.26 28.83,46.48 52.07,46.48 54.48,48.9 A29.P1
X034
  Top 0.254: IC3.23 29.59,48.26 31.37,46.48 52.83,46.48 57.28,50.93 73.15,50.93 A30.N2
X035
  Bottom 0.254: IC3.24 32.13,48.26 36.96,53.09 53.85,53.09 53.98,53.21 66.8,53.21 A30.N1
X036
  Bottom 0.254: IC3.25 34.67,48.26 37.34,50.93 60.45,50.93 A29.N2
X037
  Top 0.254: IC3.26 37.21,48.26 41.02,52.07 A29.N1
X038
  Bottom 0.254: IC3.27 39.75,48.26 41.91,50.42 70.23,50.42 75.06,55.24 A30.M2
X039
  Top 0.254: IC3.28 53.85,48.26 59.69,54.1 69.98,54.1 A30.M1
X040
  Top 0.254: IC3.1 55.88,55.88 59.94,59.94 69.47,59.94 A30.K1
X041
  Top 0.254: IC3.2 39.75,55.88 41.53,54.1 54.86,54.1 58.04,57.28 70.74,57.28 75.06,61.59 A30.K2
X042
  Top 0.254: IC3.3 37.21,55.88 39.75,58.42 A29.L1
X043
  Bottom 0.254: IC3.4 34.67,55.88 38.35,59.56 60.45,59.56 A29.L2
X044
  Bottom 0.254: IC3.5 32.13,55.88 33.91,54.1 53.34,54.1 56.52,57.28 66.8,57.28 A30.L1
X045
  Bottom 0.254: IC3.6 29.59,55.88 33.78,60.07 72.64,60.07 A30.L2
X046
  Top 0.254: IC3.7 27.05,55.88 29.34,53.59 56.77,53.59 A29.M1
X047
  Bottom 0.254: IC3.8 24.51,55.88 26.8,53.59 53.59,53.59 54.1,54.1 63.63,54.1 A29.M2
X048
  Top 0.254: IC4.21 24.51,33.02 26.8,30.73 56.9,30.73 62.36,36.2 A29.U2
X049
  Bottom 0.254: IC4.22 27.05,33.02 28.83,31.24 42.29,31.24 47.24,36.2 A29.U1
X050
  Top 0.254: IC4.23 29.59,33.02 31.37,31.24 56.64,31.24 63.12,37.72 72.64,37.72 A30.T2
X051
  Bottom 0.254: IC4.24 32.13,33.02 37.34,38.23 66.8,38.23 A30.T1
X052
  Top 0.254: IC4.25 34.67,33.02 40.01,38.35 51.82,38.35 53.98,40.51 60.45,40.51 A29.T2
X053
  Top 0.254: IC4.26 37.21,33.02 42.04,37.85 53.72,37.85 A29.T1
X054
  Bottom 0.254: IC4.27 39.75,33.02 44.45,37.72 70.23,37.72 75.06,42.55 A30.S2
X055
  Top 0.254: IC4.28 52.83,33.02 58.04,38.23 64.39,38.23 68.71,42.55 A30.S1
X056
  Top 0.254: IC4.1 52.58,40.64 59.18,47.24 69.47,47.24 A30.P1
X057
  Bottom 0.254: IC4.2 39.75,40.64 43.56,44.45 70.61,44.45 75.06,48.9 A30.P2
X058
  Bottom 0.254: IC4.3 37.21,40.64 41.53,44.96 54.48,44.96 A29.R1
X059
  Bottom 0.254: IC4.4 34.67,40.64 39.5,45.47 52.58,45.47 53.98,46.86 60.45,46.86 A29.R2
X060
  Bottom 0.254: IC4.5 32.13,40.64 37.47,45.97 52.32,45.97 53.72,47.37 66.29,47.37 A30.R1
X061
  Top 0.254: IC4.6 29.59,40.64 31.37,38.86 51.56,38.86 57.28,44.58 73.15,44.58 A30.R2
X062  (via drill 0.61)
  Top 0.254: IC4.7 27.05,40.64 28.96,42.55 v53.21,42.55
  Bottom 0.254: A29.S1 v53.21,42.55
X063
  Bottom 0.254: IC4.8 24.51,40.64 26.29,38.86 52.32,38.86 54.86,41.4 63.63,41.4 A29.S2
X064
  Top 0.254: IC5.21 24.13,8.89 OUT1.6
X065
  Top 0.254: IC5.22 26.67,8 27.81,6.86 27.81,4.95 OUT1.5
X066
  Top 0.254: OUT1.8 IC5.23
X067
  Top 0.254: IC5.24 31.75,8 30.35,6.6 30.35,4.95 OUT1.7
X068
  Top 0.254: IC5.25 34.29,8.89 OUT1.10
X069
  Top 0.254: IC5.26 36.83,10.54 32.89,6.6 32.89,4.95 OUT1.9
X070
  Top 0.254: IC5.27 39.37,11.43 OUT1.12
X071
  Top 0.254: IC5.28 41.91,11.43 OUT1.11
X072
  Top 0.254: IC5.1 57.91,25.4 68.71,36.2 A30.U1
X073
  Bottom 0.254: IC5.2 39.75,25.4 46.23,31.88 64.39,31.88 67.56,35.05 76.33,35.05 A30.U2
X074
  Bottom 0.254: IC5.3 37.21,25.4 44.83,33.02 A29.V1
X075
  Top 0.254: IC5.4 34.67,25.4 39.5,30.23 58.8,30.23 A29.V2
X076
  Bottom 0.254: IC5.5 32.13,25.4 33.91,23.62 58.55,23.62 A30.V1
X077
  Top 0.254: IC5.6 29.59,25.4 31.37,23.62 64.9,23.62 A30.V2
X078
  Bottom 0.254: IC5.7 26.67,19.94 25.27,18.54 25.27,4.95 OUT1.3
X079
  Top 0.254: IC5.8 24.13,19.94 22.99,18.8 22.99,7.49 OUT1.4
X080
  Top 0.254: IC6.21 135.51,86.36 132.72,89.15 85.98,89.15 A31.A1
X081
  Bottom 0.254: IC6.22 132.97,86.36 130.68,88.65 91.82,88.65 A31.A2
X082
  Bottom 0.254: IC6.23 130.43,86.36 128.65,88.14 97.66,88.14 A32.A1
X083
  Bottom 0.254: IC6.24 127.89,86.36 126.11,84.58 105.28,84.58 A32.A2
X084
  Top 0.254: IC6.25 125.35,86.36 123.06,88.65 87.88,88.65 83.06,83.82 A31.B1
X085
  Top 0.254: IC6.26 122.81,86.36 119.13,82.68 88.14,82.68 A31.B2
X086
  Top 0.254: IC6.27 120.27,86.36 118.49,88.14 100.08,88.14 95.76,83.82 A32.B1
X087
  Top 0.254: IC6.28 104.65,86.36 102.11,83.82 A32.B2
X088
  Bottom 0.254: IC6.1 104.14,78.74 102.87,77.47 A32.D2
X089
  Bottom 0.254: IC6.2 120.27,78.74 118.49,80.52 105.16,80.52 103.25,78.61 94.49,78.61 A32.D1
X090
  Bottom 0.254: IC6.3 122.81,78.74 119.76,81.79 93.73,81.79 89.41,77.47 A31.D2
X091
  Bottom 0.254: IC6.4 125.35,78.74 122.94,76.33 81.79,76.33 A31.D1
X092
  Top 0.254: IC6.5 127.89,78.74 125.98,80.64 A32.C2
X093
  Top 0.254: IC6.6 130.43,78.74 127.38,81.79 97.66,81.79 A32.C1
X094
  Bottom 0.254: IC6.7 132.97,78.74 129.41,82.3 91.82,82.3 A31.C2
X095
  Top 0.254: IC6.8 135.51,78.74 133.73,76.96 102.62,76.96 100.08,79.5 84.96,79.5 A31.C1
X096
  Top 0.254: IC7.21 135.51,71.12 130.68,75.95 85.47,75.95 A31.E1
X097
  Top 0.254: IC7.22 132.97,71.12 128.65,75.44 91.31,75.44 A31.E2
X098
  Bottom 0.254: IC7.23 130.43,71.12 128.65,69.34 103.89,69.34 98.93,74.3 A32.E1
X099
  Top 0.254: IC7.24 127.89,71.12 124.71,74.3 A32.E2
X100
  Bottom 0.254: IC7.25 125.35,71.12 121.03,75.44 87.38,75.44 83.06,71.12 A31.F1
X101
  Top 0.254: IC7.26 122.81,71.12 121.03,72.9 88.77,72.9 A31.F2
X102
  Top 0.254: IC7.27 120.27,71.12 118.49,69.34 104.65,69.34 104.01,69.98 94.49,69.98 A32.F1
X103
  Top 0.254: A32.F2 IC7.28
X104
  Top 0.254: IC7.1 100.97,63.5 A32.J2
X105
  Top 0.254: IC7.2 120.27,63.5 117.86,65.91 94.49,65.91 A32.J1
X106
  Bottom 0.254: IC7.3 122.81,63.5 120.02,66.29 95.76,66.29 92.96,69.09 88.9,69.09 87,67.18 A31.J2
X107
  Top 0.254: IC7.4 125.35,63.5 122.43,66.42 82.3,66.42 A31.J1
X108
  Top 0.254: IC7.5 127.89,63.5 123.44,67.94 A32.H2
X109
  Bottom 0.254: IC7.6 130.43,63.5 127.13,66.8 97.66,66.8 A32.H1
X110
  Bottom 0.254: IC7.7 132.97,63.5 131.19,61.72 105.16,61.72 103.25,63.63 97.66,63.63 93.34,67.94 A31.H2
X111
  Top 0.254: IC7.8 135.51,63.5 130.18,68.83 104.39,68.83 104.14,69.09 84.96,69.09 A31.H1
X112
  Bottom 0.254: IC8.21 135.51,55.88 133.73,57.66 125.35,57.66 124.33,56.64 124.33,54.86 123.57,54.1 101.6,54.1 92.96,62.74 84.96,62.74 A31.K1
X113
  Bottom 0.254: IC8.22 132.97,55.88 130.68,53.59 101.35,53.59 93.34,61.59 A31.K2
X114
  Top 0.254: IC8.23 130.43,55.88 124.59,61.72 105.16,61.72 104.14,62.74 97.66,62.74 A32.K1
X115
  Top 0.254: IC8.24 127.89,55.88 122.56,61.21 103.25,61.21 A32.K2
X116
  Top 0.254: IC8.25 125.35,55.88 121.67,59.56 81.79,59.56 A31.L1
X117
  Bottom 0.254: IC8.26 122.81,55.88 118.75,59.94 100.58,59.94 97.28,63.25 83.06,63.25 81.92,62.1 81.92,61.09 84.58,58.42 A31.L2
X118
  Top 0.254: IC8.27 120.27,55.88 118.49,57.66 101.35,57.66 100.97,57.28 94.49,57.28 A32.L1
X119
  Bottom 0.254: IC8.28 104.65,55.88 102.11,58.42 A32.L2
X120
  Top 0.254: IC8.1 108.46,48.26 104.65,52.07 A32.N2
X121  (via drill 0.61)
  Top 0.254: v105.28,50.16 104.78,50.16 104.01,50.93 94.49,50.93 A32.N1
  Bottom 0.254: IC8.2 120.27,48.26 118.36,50.16 v105.28,50.16
X122
  Top 0.254: IC8.3 122.81,48.26 117.98,53.09 101.09,53.09 100.97,53.21 88.14,53.21 A31.N2
X123
  Bottom 0.254: IC8.4 125.35,48.26 122.56,51.05 101.85,51.05 101.22,50.42 91.82,50.42 91.31,50.93 81.79,50.93 A31.N1
X124
  Top 0.254: IC8.5 127.89,48.26 122.56,53.59 104.52,53.59 A32.M2
X125
  Bottom 0.254: IC8.6 130.43,48.26 125.6,53.09 101.09,53.09 98.93,55.24 A32.M1
X126
  Bottom 0.254: IC8.7 132.97,48.26 131.19,46.48 127.89,46.48 126.87,47.5 126.87,49.28 124.59,51.56 101.6,51.56 100.97,50.93 96.9,50.93 92.58,55.24 A31.M2
X127
  Top 0.254: IC8.8 135.51,48.26 129.67,54.1 106.43,54.1 104.14,56.39 84.96,56.39 A31.M1
X128
  Bottom 0.254: IC9.21 135.51,40.64 130.94,45.21 102.62,45.21 100.08,47.75 93.73,47.75 91.44,50.04 84.96,50.04 A31.P1
X129
  Bottom 0.254: IC9.22 132.97,40.64 129.67,37.34 105.66,37.34 95.76,47.24 91.82,47.24 A31.P2
X130  (via drill 0.61)
  Top 0.254: IC9.23 130.81,41.02 v125.73,46.1
  Bottom 0.254: v125.73,46.1 102.49,46.1 99.69,48.9 A32.P1
X131
  Top 0.254: IC9.24 127.89,40.64 123.83,44.7 119.51,44.7 118.24,45.97 105.79,45.97 A32.P2
X132
  Top 0.254: IC9.25 126.11,40.64 127.89,38.86 128.65,38.86 129.41,39.62 129.41,41.66 125.86,45.21 119.76,45.21 118.49,46.48 107.7,46.48 104.14,50.04 87.38,50.04 83.06,45.72 A31.R1
X133
  Top 0.254: IC9.26 122.81,40.64 117.98,45.47 102.36,45.47 100.97,46.86 88.14,46.86 A31.R2
X134
  Top 0.254: IC9.27 120.27,40.64 116.33,44.58 94.49,44.58 A32.R1
X135
  Bottom 0.254: IC9.28 107.19,40.64 103.12,44.7 100.71,44.7 A32.R2
X136
  Bottom 0.254: IC9.1 108.46,33.02 102.11,39.37 A32.T2
X137
  Top 0.254: IC9.2 120.27,33.02 115.44,37.85 94.87,37.85 A32.T1
X138
  Bottom 0.254: IC9.3 122.81,33.02 121.03,31.24 103.89,31.24 91.44,43.69 88.9,43.69 87,41.78 A31.T2
X139
  Top 0.254: IC9.4 125.35,33.02 120.02,38.35 103.12,38.35 100.97,40.51 81.79,40.51 A31.T1
X140  (via drill 0.61)
  Top 0.254: IC9.5 128.27,34.16 v124.21,38.23
  Bottom 0.254: v124.21,38.23 107.19,38.23 A32.S2
X141
  Bottom 0.254: IC9.6 130.43,33.02 126.62,36.83 105.41,36.83 99.69,42.55 A32.S1
X142
  Bottom 0.254: IC9.7 132.97,33.02 130.68,30.73 99.57,30.73 90.17,40.13 A31.S2
X143
  Top 0.254: IC9.8 135.51,33.02 130.18,38.35 125.35,38.35 124.59,39.12 123.83,39.12 123.57,38.86 103.38,38.86 100.84,41.4 84.96,41.4 A31.S1
X144
  Top 0.254: IC10.21 135.51,25.4 133.73,23.62 98.81,23.62 86.23,36.2 A31.U1
X145
  Bottom 0.254: IC10.22 132.97,25.4 128.14,30.23 98.55,30.23 92.58,36.2 A31.U2
X146
  Top 0.254: IC10.23 130.43,25.4 124.59,31.24 110.24,31.24 104.14,37.34 97.66,37.34 A32.U1
X147
  Top 0.254: IC10.24 127.89,25.4 122.56,30.73 108.33,30.73 A32.U2
X148
  Bottom 0.254: IC10.25 125.35,25.4 123.57,23.62 90.04,23.62 A31.V1
X149
  Bottom 0.254: IC10.26 122.81,25.4 118.49,29.72 90.3,29.72 A31.V2
X150
  Top 0.254: IC10.27 120.27,25.4 115.44,30.23 104.9,30.23 100.97,34.16 94.49,34.16 A32.V1
X151
  Top 0.254: IC10.28 107.31,25.4 A32.V2
X152
  Top 0.254: IC10.1 118.11,15.62 127.13,6.6 127.13,4.95 OUT2.3
X153
  Top 0.254: IC10.2 120.65,13.97 OUT2.4
X154
  Top 0.254: IC10.3 123.19,13.08 129.67,6.6 129.67,4.95 OUT2.5
X155
  Top 0.254: IC10.4 125.73,11.43 OUT2.6
X156
  Top 0.254: IC10.5 128.27,14.22 132.21,10.29 132.21,4.95 OUT2.7
X157
  Top 0.254: IC10.6 130.81,12.45 133.35,9.91 OUT2.8
X158
  Top 0.254: IC10.7 133.35,10.92 134.75,9.53 134.75,4.95 OUT2.9
X159
  Top 0.254: OUT2.10 IC10.8

### Text on the board
tNames: A29 | A30 | A31 | A32 | 2 | 1 | INDICATOR PANEL CONTROLLER | PA8PDP | JLCJLCJLCJLC | GND | +5V | GND | GND | CTS | +5V | TXD | RXD | RTS